# Altium project MiniPC MB GOST.PrjPcb (part 20 of 31)

## Sheet PCIE Connector.SchDoc
size 420 x 297 mm; Author: ALTIUM GOSTBOM2.0 KEV; SheetNumber: 16; SheetTotal: 48
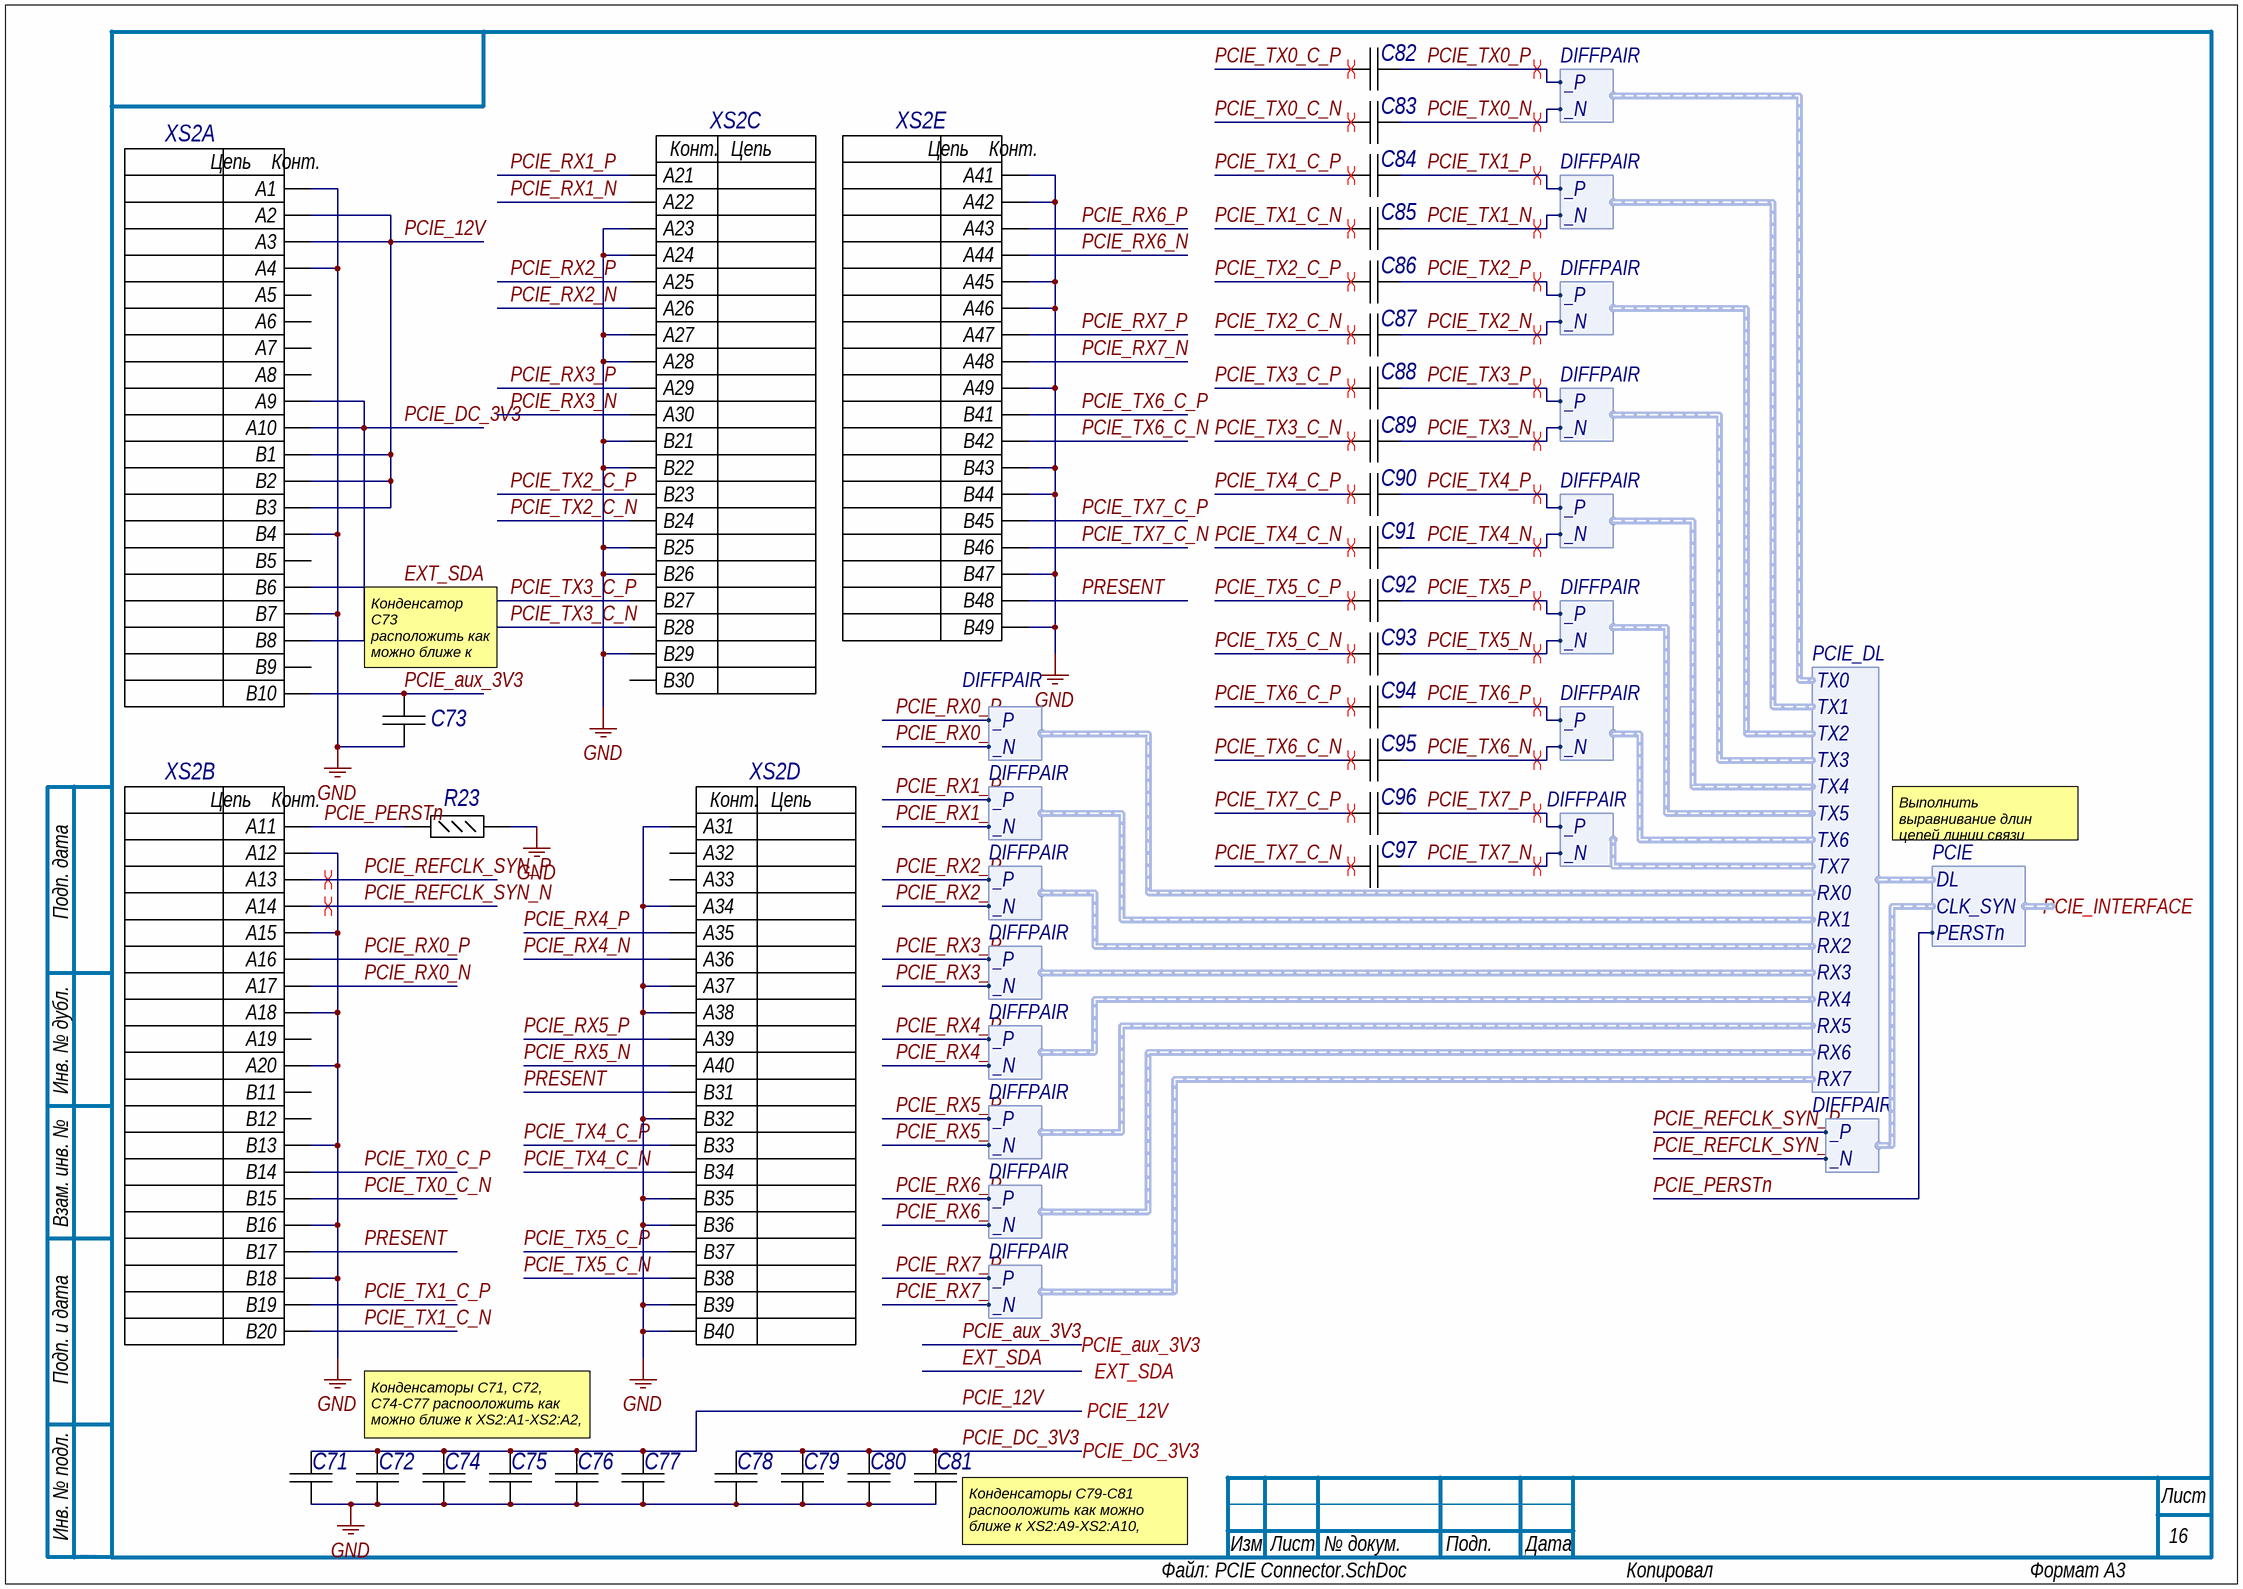
[diagram p27: PCIE Connector.SchDoc]

### Parts
C71  GRM31CR61E226KE15L  [CAPC3216X180X55ML20T25]  (value not drawn)
C72  C1005X7R1E104M  [CAPC1005X55X10LL05]  (value not drawn)
C73  C1005X7R1E104M  [CAPC1005X55X10LL05]  (value not drawn)
C74  C1005X7R1E104M  [CAPC1005X55X10LL05]  (value not drawn)
C75  C1005X7R1E104M  [CAPC1005X55X10LL05]  (value not drawn)
C76  C1005X7R1E104M  [CAPC1005X55X10LL05]  (value not drawn)
C77  C1005X7R1E104M  [CAPC1005X55X10LL05]  (value not drawn)
C78  C1005X7R1E104M  [CAPC1005X55X10LL05]  (value not drawn)
C79  C1005X7R1E104M  [CAPC1005X55X10LL05]  (value not drawn)
C80  C1005X7R1E104M  [CAPC1005X55X10LL05]  (value not drawn)
C81  GRM31CR60J107ME39L  [CAPC3216X190X55ML30T25]  (value not drawn)
C82  GRM155R61A224KE19D  [CAPC1005X55X25NL05T10]  (value not drawn)
C83  GRM155R61A224KE19D  [CAPC1005X55X25NL05T10]  (value not drawn)
C84  GRM155R61A224KE19D  [CAPC1005X55X25NL05T10]  (value not drawn)
C85  GRM155R61A224KE19D  [CAPC1005X55X25NL05T10]  (value not drawn)
C86  GRM155R61A224KE19D  [CAPC1005X55X25NL05T10]  (value not drawn)
C87  GRM155R61A224KE19D  [CAPC1005X55X25NL05T10]  (value not drawn)
C88  GRM155R61A224KE19D  [CAPC1005X55X25NL05T10]  (value not drawn)
C89  GRM155R61A224KE19D  [CAPC1005X55X25NL05T10]  (value not drawn)
C90  GRM155R61A224KE19D  [CAPC1005X55X25NL05T10]  (value not drawn)
C91  GRM155R61A224KE19D  [CAPC1005X55X25NL05T10]  (value not drawn)
C92  GRM155R61A224KE19D  [CAPC1005X55X25NL05T10]  (value not drawn)
C93  GRM155R61A224KE19D  [CAPC1005X55X25NL05T10]  (value not drawn)
C94  GRM155R61A224KE19D  [CAPC1005X55X25NL05T10]  (value not drawn)
C95  GRM155R61A224KE19D  [CAPC1005X55X25NL05T10]  (value not drawn)
C96  GRM155R61A224KE19D  [CAPC1005X55X25NL05T10]  (value not drawn)
C97  GRM155R61A224KE19D  [CAPC1005X55X25NL05T10]  (value not drawn)
R23  ERJ-2RKF4701X  [RESC1005X40X25LL05T05]  (value not drawn)
XS2  PCIE-098-02-F-D-TH  [SMTC-PCIE-098-02-F-D-TH_V]  (value not drawn)  (parts A,B,C,D,E of 5)

### Ports
EXT_SDA, PCIE_12V, PCIE_aux_3V3, PCIE_DC_3V3, PCIE_INTERFACE (harness PCIE)

### Harnesses
PCIE_DL: RX0, RX1, RX2, RX3, RX4, RX5, RX6, RX7, TX0, TX1, TX2, TX3, TX4, TX5, TX6, TX7
DIFFPAIR: _P, _N
PCIE: DL, CLK_SYN, PERSTn

### Nets
GND: C71.1 C72.1 C73.1 C74.1 C75.1 C76.1 C77.1 C78.1 C79.1 C80.1 C81.1 R23.2 XS2.A1 XS2.A4 XS2.A12 XS2.A15 XS2.A18 XS2.A20 XS2.A23 XS2.A24 XS2.A27 XS2.A28 XS2.A31 XS2.A34 XS2.A37 XS2.A38 XS2.A41 XS2.A42 XS2.A45 XS2.A46 XS2.A49 XS2.B4 XS2.B7 XS2.B13 XS2.B16 XS2.B18 XS2.B21 XS2.B22 XS2.B25 XS2.B26 XS2.B29 XS2.B32 XS2.B35 XS2.B36 XS2.B39 XS2.B40 XS2.B43 XS2.B44 XS2.B47 XS2.B49
EXT_SDA: XS2.B6 ; port EXT_SDA
PCIE_12V: C71.2 C72.2 C74.2 C75.2 C76.2 C77.2 XS2.A2 XS2.A3 XS2.B1 XS2.B2 XS2.B3 ; port PCIE_12V  [project net aux_12V]
PCIE_aux_3V3: C73.2 XS2.B10 ; port PCIE_aux_3V3  [project net PCIE_aux3V3]
PCIE_DC_3V3: C78.2 C79.2 C80.2 C81.2 XS2.A9 XS2.A10 XS2.B8 ; port PCIE_DC_3V3
PCIE_PERSTn: R23.1 XS2.A11 ; port PCIE_INTERFACE.PERSTn  [project net PCIE.PERSTn]
PCIE_REFCLK_SYN_N: XS2.A14 ; harness DIFFPAIR._N
PCIE_REFCLK_SYN_P: XS2.A13 ; harness DIFFPAIR._P
PCIE_RX0_N: XS2.A17 ; harness DIFFPAIR._N
PCIE_RX0_P: XS2.A16 ; harness DIFFPAIR._P
PCIE_RX1_N: XS2.A22 ; harness DIFFPAIR._N
PCIE_RX1_P: XS2.A21 ; harness DIFFPAIR._P
PCIE_RX2_N: XS2.A26 ; harness DIFFPAIR._N
PCIE_RX2_P: XS2.A25 ; harness DIFFPAIR._P
PCIE_RX3_N: XS2.A30 ; harness DIFFPAIR._N
PCIE_RX3_P: XS2.A29 ; harness DIFFPAIR._P
PCIE_RX4_N: XS2.A36 ; harness DIFFPAIR._N
PCIE_RX4_P: XS2.A35 ; harness DIFFPAIR._P
PCIE_RX5_N: XS2.A40 ; harness DIFFPAIR._N
PCIE_RX5_P: XS2.A39 ; harness DIFFPAIR._P
PCIE_RX6_N: XS2.A44 ; harness DIFFPAIR._N
PCIE_RX6_P: XS2.A43 ; harness DIFFPAIR._P
PCIE_RX7_N: XS2.A48 ; harness DIFFPAIR._N
PCIE_RX7_P: XS2.A47 ; harness DIFFPAIR._P
PCIE_TX0_C_N: C83.2 XS2.B15  [project net PCIE_TX0_C_N_16]
PCIE_TX0_C_P: C82.2 XS2.B14  [project net PCIE_TX0_C_P_16]
PCIE_TX0_N: C83.1 ; harness DIFFPAIR._N
PCIE_TX0_P: C82.1 ; harness DIFFPAIR._P
PCIE_TX1_C_N: C85.2 XS2.B20  [project net PCIE_TX1_C_N_16]
PCIE_TX1_C_P: C84.2 XS2.B19  [project net PCIE_TX1_C_P_16]
PCIE_TX1_N: C85.1 ; harness DIFFPAIR._N
PCIE_TX1_P: C84.1 ; harness DIFFPAIR._P
PCIE_TX2_C_N: C87.2 XS2.B24  [project net PCIE_TX2_C_N_16]
PCIE_TX2_C_P: C86.2 XS2.B23  [project net PCIE_TX2_C_P_16]
PCIE_TX2_N: C87.1 ; harness DIFFPAIR._N
PCIE_TX2_P: C86.1 ; harness DIFFPAIR._P
PCIE_TX3_C_N: C89.2 XS2.B28  [project net PCIE_TX3_C_N_16]
PCIE_TX3_C_P: C88.2 XS2.B27  [project net PCIE_TX3_C_P_16]
PCIE_TX3_N: C89.1 ; harness DIFFPAIR._N
PCIE_TX3_P: C88.1 ; harness DIFFPAIR._P
PCIE_TX4_C_N: C91.2 XS2.B34  [project net PCIE_TX4_C_N_16]
PCIE_TX4_C_P: C90.2 XS2.B33  [project net PCIE_TX4_C_P_16]
PCIE_TX4_N: C91.1 ; harness DIFFPAIR._N
PCIE_TX4_P: C90.1 ; harness DIFFPAIR._P
PCIE_TX5_C_N: C93.2 XS2.B38  [project net PCIE_TX5_C_N_16]
PCIE_TX5_C_P: C92.2 XS2.B37  [project net PCIE_TX5_C_P_16]
PCIE_TX5_N: C93.1 ; harness DIFFPAIR._N
PCIE_TX5_P: C92.1 ; harness DIFFPAIR._P
PCIE_TX6_C_N: C95.2 XS2.B42  [project net PCIE_TX6_C_N_16]
PCIE_TX6_C_P: C94.2 XS2.B41  [project net PCIE_TX6_C_P_16]
PCIE_TX6_N: C95.1 ; harness DIFFPAIR._N
PCIE_TX6_P: C94.1 ; harness DIFFPAIR._P
PCIE_TX7_C_N: C97.2 XS2.B46  [project net PCIE_TX7_C_N_16]
PCIE_TX7_C_P: C96.2 XS2.B45  [project net PCIE_TX7_C_P_16]
PCIE_TX7_N: C97.1 ; harness DIFFPAIR._N
PCIE_TX7_P: C96.1 ; harness DIFFPAIR._P
PRESENT: XS2.B17 XS2.B31 XS2.B48  [project net PRESENT_16]

Not connected (* = marked no-connect by the designer): XS2 A5 A6 A7 A8 A19 A32 A33 B5 B9 B11 B12 B30

### Layout directives
differential pair: PCIE_REFCLK_SYN_N, PCIE_REFCLK_SYN_P, PCIE_TX0_C_N_16, PCIE_TX0_C_P_16, PCIE_TX0_N, PCIE_TX0_P, PCIE_TX1_C_N_16, PCIE_TX1_C_P_16, PCIE_TX1_N, PCIE_TX1_P, PCIE_TX2_C_N_16, PCIE_TX2_C_P_16, PCIE_TX2_N, PCIE_TX2_P, PCIE_TX3_C_N_16, PCIE_TX3_C_P_16, PCIE_TX3_N, PCIE_TX3_P, PCIE_TX4_C_N_16, PCIE_TX4_C_P_16, PCIE_TX4_N, PCIE_TX4_P, PCIE_TX5_C_N_16, PCIE_TX5_C_P_16, PCIE_TX5_N, PCIE_TX5_P, PCIE_TX6_C_N_16, PCIE_TX6_C_P_16, PCIE_TX6_N, PCIE_TX6_P, PCIE_TX7_C_N_16, PCIE_TX7_C_P_16, PCIE_TX7_N, PCIE_TX7_P

### Notes on the sheet
- (near C73) Конденсатор C73 расположить как можно ближе к XS2:B10.
- Выполнить выравнивание длин цепей линии связи PCIE.DL.
- Конденсаторы C71, C72, C74-C77 распооложить как можно ближе к XS2:A1-XS2:A2, XS2:B1-XS2:B3.
- (near C81) Конденсаторы C79-C81 распооложить как можно ближе к XS2:A9-XS2:A10, XS2:B8.
- Подп. дата
- Инв. № дубл.
- Взам. инв. №
- Подп. и дата
- Инв. № подл.
- Изм.
- Лист
- № докум.
- Подп.
- Дата
- ALTIUM GOSTBOM2.0 KEV
- Файл:
- Копировал
- Формат А3
- (in symbol E41, part A) Цепь; Конт.
- (in symbol E41, part B) Цепь; Конт.
- (in symbol E41, part C) Конт.; Цепь
- (in symbol E41, part D) Конт.; Цепь
- (in symbol E41, part E) Цепь; Конт.

### Library data of the parts
C71 = E5: Chip Capacitor, 22 uF, +/- 10%, 25 V, -55 to 85 degC, 1206 (3216 Metric), RoHS, Tape and Reel; Тип элемента: Конденсатор; Capacitance: 22 uF; Case\/Package: 1206; Type (Capacitors): X5R; Voltage Rating: 25 V; Old_des: C500; New_des: C71; UID: E5; Component Kind: Standard; Case Code (Imperial): 1206; Case Code (Metric): 3216; ComponentLink1Description: Manufacturer URL; ComponentLink1URL: http://www.murata.com/; ComponentLink2Description: Datasheet; ComponentLink2URL: http://search.murata.co.jp/Ceramy/image/img/A01X/G101/ENG/GRM31CR61E226KE15-01.pdf; DatasheetVersion: 03/2016; Length: 3.2 mm; Max Operating Temperature: 85 degC; Min Operating Temperature: -55 degC; Mounting Technology: Surface Mount; Package Quantity: 2000; PackageDescription: 2-Pin Surface Mount Device, Body 3.2 x 1.6 mm; Packaging: Tape and Reel; PartNumber: GRM31CR61E226KE15L; RoHSCompliant: true; Tolerance: 10%; Width: 1.6 mm; Height: 1.6 mm; Mount: Surface Mount; PackageReference: 1206; Pins: 2; Radiation Hardening: No; REACH SVHC: No SVHC; Voltage Rating (DC): 25 V
C72 = E11: Chip Capacitor, 0.1 uF, +/- 20%, 25 V, -55 to 125 degC, 0402 (1005 Metric), RoHS, Tape and Reel; Тип элемента: Конденсатор; Capacitance: 100 nF; Case\/Package: 0402; Type (Capacitors): X7R; Voltage Rating: 25 V; Old_des: C501; New_des: C72; UID: E11; Component Kind: Standard; Case Code (Imperial): 0402; Case Code (Metric): 1005; ComponentLink1Description: Manufacturer URL; ComponentLink1URL: http://www.tdk.com/; ComponentLink2Description: Datasheet; ComponentLink2URL: http://www.farnell.com/datasheets/1571323.pdf; DatasheetVersion: 09/2011; Length: 1 mm; Max Operating Temperature: 125 degC; Min Operating Temperature: -55 degC; Mounting Technology: Surface Mount; Package Quantity: 10000; PackageDescription: 2-Pin Surface Mount Device, Body 1 x 0.5 mm; Packaging: Tape and Reel; PartNumber: C1005X7R1E104M; RoHSCompliant: true; Tolerance: 20%; Width: 0.5 mm; Height: 0.5 mm; Mount: Surface Mount; PackageReference: 0402; Pins: 2; Voltage Rating (DC): 25 V
C73 = E11: Chip Capacitor, 0.1 uF, +/- 20%, 25 V, -55 to 125 degC, 0402 (1005 Metric), RoHS, Tape and Reel; Тип элемента: Конденсатор; Capacitance: 100 nF; Case\/Package: 0402; Type (Capacitors): X7R; Voltage Rating: 25 V; Old_des: C483; New_des: C73; UID: E11; Component Kind: Standard; Case Code (Imperial): 0402; Case Code (Metric): 1005; ComponentLink1Description: Manufacturer URL; ComponentLink1URL: http://www.tdk.com/; ComponentLink2Description: Datasheet; ComponentLink2URL: http://www.farnell.com/datasheets/1571323.pdf; DatasheetVersion: 09/2011; Length: 1 mm; Max Operating Temperature: 125 degC; Min Operating Temperature: -55 degC; Mounting Technology: Surface Mount; Package Quantity: 10000; PackageDescription: 2-Pin Surface Mount Device, Body 1 x 0.5 mm; Packaging: Tape and Reel; PartNumber: C1005X7R1E104M; RoHSCompliant: true; Tolerance: 20%; Width: 0.5 mm; Height: 0.5 mm; Mount: Surface Mount; PackageReference: 0402; Pins: 2; Voltage Rating (DC): 25 V
C74 = E11: Chip Capacitor, 0.1 uF, +/- 20%, 25 V, -55 to 125 degC, 0402 (1005 Metric), RoHS, Tape and Reel; Тип элемента: Конденсатор; Capacitance: 100 nF; Case\/Package: 0402; Type (Capacitors): X7R; Voltage Rating: 25 V; Old_des: C502; New_des: C74; UID: E11; Component Kind: Standard; Case Code (Imperial): 0402; Case Code (Metric): 1005; ComponentLink1Description: Manufacturer URL; ComponentLink1URL: http://www.tdk.com/; ComponentLink2Description: Datasheet; ComponentLink2URL: http://www.farnell.com/datasheets/1571323.pdf; DatasheetVersion: 09/2011; Length: 1 mm; Max Operating Temperature: 125 degC; Min Operating Temperature: -55 degC; Mounting Technology: Surface Mount; Package Quantity: 10000; PackageDescription: 2-Pin Surface Mount Device, Body 1 x 0.5 mm; Packaging: Tape and Reel; PartNumber: C1005X7R1E104M; RoHSCompliant: true; Tolerance: 20%; Width: 0.5 mm; Height: 0.5 mm; Mount: Surface Mount; PackageReference: 0402; Pins: 2; Voltage Rating (DC): 25 V
C75 = E11: Chip Capacitor, 0.1 uF, +/- 20%, 25 V, -55 to 125 degC, 0402 (1005 Metric), RoHS, Tape and Reel; Тип элемента: Конденсатор; Capacitance: 100 nF; Case\/Package: 0402; Type (Capacitors): X7R; Voltage Rating: 25 V; Old_des: C503; New_des: C75; UID: E11; Component Kind: Standard; Case Code (Imperial): 0402; Case Code (Metric): 1005; ComponentLink1Description: Manufacturer URL; ComponentLink1URL: http://www.tdk.com/; ComponentLink2Description: Datasheet; ComponentLink2URL: http://www.farnell.com/datasheets/1571323.pdf; DatasheetVersion: 09/2011; Length: 1 mm; Max Operating Temperature: 125 degC; Min Operating Temperature: -55 degC; Mounting Technology: Surface Mount; Package Quantity: 10000; PackageDescription: 2-Pin Surface Mount Device, Body 1 x 0.5 mm; Packaging: Tape and Reel; PartNumber: C1005X7R1E104M; RoHSCompliant: true; Tolerance: 20%; Width: 0.5 mm; Height: 0.5 mm; Mount: Surface Mount; PackageReference: 0402; Pins: 2; Voltage Rating (DC): 25 V
C76 = E11: Chip Capacitor, 0.1 uF, +/- 20%, 25 V, -55 to 125 degC, 0402 (1005 Metric), RoHS, Tape and Reel; Тип элемента: Конденсатор; Capacitance: 100 nF; Case\/Package: 0402; Type (Capacitors): X7R; Voltage Rating: 25 V; Old_des: C504; New_des: C76; UID: E11; Component Kind: Standard; Case Code (Imperial): 0402; Case Code (Metric): 1005; ComponentLink1Description: Manufacturer URL; ComponentLink1URL: http://www.tdk.com/; ComponentLink2Description: Datasheet; ComponentLink2URL: http://www.farnell.com/datasheets/1571323.pdf; DatasheetVersion: 09/2011; Length: 1 mm; Max Operating Temperature: 125 degC; Min Operating Temperature: -55 degC; Mounting Technology: Surface Mount; Package Quantity: 10000; PackageDescription: 2-Pin Surface Mount Device, Body 1 x 0.5 mm; Packaging: Tape and Reel; PartNumber: C1005X7R1E104M; RoHSCompliant: true; Tolerance: 20%; Width: 0.5 mm; Height: 0.5 mm; Mount: Surface Mount; PackageReference: 0402; Pins: 2; Voltage Rating (DC): 25 V
C77 = E11: Chip Capacitor, 0.1 uF, +/- 20%, 25 V, -55 to 125 degC, 0402 (1005 Metric), RoHS, Tape and Reel; Тип элемента: Конденсатор; Capacitance: 100 nF; Case\/Package: 0402; Type (Capacitors): X7R; Voltage Rating: 25 V; Old_des: C505; New_des: C77; UID: E11; Component Kind: Standard; Case Code (Imperial): 0402; Case Code (Metric): 1005; ComponentLink1Description: Manufacturer URL; ComponentLink1URL: http://www.tdk.com/; ComponentLink2Description: Datasheet; ComponentLink2URL: http://www.farnell.com/datasheets/1571323.pdf; DatasheetVersion: 09/2011; Length: 1 mm; Max Operating Temperature: 125 degC; Min Operating Temperature: -55 degC; Mounting Technology: Surface Mount; Package Quantity: 10000; PackageDescription: 2-Pin Surface Mount Device, Body 1 x 0.5 mm; Packaging: Tape and Reel; PartNumber: C1005X7R1E104M; RoHSCompliant: true; Tolerance: 20%; Width: 0.5 mm; Height: 0.5 mm; Mount: Surface Mount; PackageReference: 0402; Pins: 2; Voltage Rating (DC): 25 V
C78 = E11: Chip Capacitor, 0.1 uF, +/- 20%, 25 V, -55 to 125 degC, 0402 (1005 Metric), RoHS, Tape and Reel; Тип элемента: Конденсатор; Capacitance: 100 nF; Case\/Package: 0402; Type (Capacitors): X7R; Voltage Rating: 25 V; Old_des: C506; New_des: C78; UID: E11; Component Kind: Standard; Case Code (Imperial): 0402; Case Code (Metric): 1005; ComponentLink1Description: Manufacturer URL; ComponentLink1URL: http://www.tdk.com/; ComponentLink2Description: Datasheet; ComponentLink2URL: http://www.farnell.com/datasheets/1571323.pdf; DatasheetVersion: 09/2011; Length: 1 mm; Max Operating Temperature: 125 degC; Min Operating Temperature: -55 degC; Mounting Technology: Surface Mount; Package Quantity: 10000; PackageDescription: 2-Pin Surface Mount Device, Body 1 x 0.5 mm; Packaging: Tape and Reel; PartNumber: C1005X7R1E104M; RoHSCompliant: true; Tolerance: 20%; Width: 0.5 mm; Height: 0.5 mm; Mount: Surface Mount; PackageReference: 0402; Pins: 2; Voltage Rating (DC): 25 V
C79 = E11: Chip Capacitor, 0.1 uF, +/- 20%, 25 V, -55 to 125 degC, 0402 (1005 Metric), RoHS, Tape and Reel; Тип элемента: Конденсатор; Capacitance: 100 nF; Case\/Package: 0402; Type (Capacitors): X7R; Voltage Rating: 25 V; Old_des: C507; New_des: C79; UID: E11; Component Kind: Standard; Case Code (Imperial): 0402; Case Code (Metric): 1005; ComponentLink1Description: Manufacturer URL; ComponentLink1URL: http://www.tdk.com/; ComponentLink2Description: Datasheet; ComponentLink2URL: http://www.farnell.com/datasheets/1571323.pdf; DatasheetVersion: 09/2011; Length: 1 mm; Max Operating Temperature: 125 degC; Min Operating Temperature: -55 degC; Mounting Technology: Surface Mount; Package Quantity: 10000; PackageDescription: 2-Pin Surface Mount Device, Body 1 x 0.5 mm; Packaging: Tape and Reel; PartNumber: C1005X7R1E104M; RoHSCompliant: true; Tolerance: 20%; Width: 0.5 mm; Height: 0.5 mm; Mount: Surface Mount; PackageReference: 0402; Pins: 2; Voltage Rating (DC): 25 V
C80 = E11: Chip Capacitor, 0.1 uF, +/- 20%, 25 V, -55 to 125 degC, 0402 (1005 Metric), RoHS, Tape and Reel; Тип элемента: Конденсатор; Capacitance: 100 nF; Case\/Package: 0402; Type (Capacitors): X7R; Voltage Rating: 25 V; Old_des: C508; New_des: C80; UID: E11; Component Kind: Standard; Case Code (Imperial): 0402; Case Code (Metric): 1005; ComponentLink1Description: Manufacturer URL; ComponentLink1URL: http://www.tdk.com/; ComponentLink2Description: Datasheet; ComponentLink2URL: http://www.farnell.com/datasheets/1571323.pdf; DatasheetVersion: 09/2011; Length: 1 mm; Max Operating Temperature: 125 degC; Min Operating Temperature: -55 degC; Mounting Technology: Surface Mount; Package Quantity: 10000; PackageDescription: 2-Pin Surface Mount Device, Body 1 x 0.5 mm; Packaging: Tape and Reel; PartNumber: C1005X7R1E104M; RoHSCompliant: true; Tolerance: 20%; Width: 0.5 mm; Height: 0.5 mm; Mount: Surface Mount; PackageReference: 0402; Pins: 2; Voltage Rating (DC): 25 V
C81 = E14: Chip Capacitor, 100 uF, +/- 20%, 6.3 V, -55 to 85 degC, 1206 (3216 Metric), RoHS, Tape and Reel; Тип элемента: Конденсатор; Capacitance: 100 uF; Case\/Package: 1206; Type (Capacitors): X5R; Voltage Rating: 6.3 V; Old_des: C509; New_des: C81; UID: E14; Component Kind: Standard; Case Code (Imperial): 1206; Case Code (Metric): 3216; ComponentLink1Description: Manufacturer URL; ComponentLink1URL: http://www.murata.com/; ComponentLink2Description: Datasheet; ComponentLink2URL: http://psearch.en.murata.com/capacitor/product/GRM31CR60J107ME39%23.pdf; DatasheetVersion: 09/2016; Length: 3.2 mm; Max Operating Temperature: 85 degC; Min Operating Temperature: -55 degC; Mounting Technology: Surface Mount; Package Quantity: 2000; PackageDescription: 2-Pin Surface Mount Device, Body 3.2 x 1.6 mm; Packaging: Tape and Reel; PartNumber: GRM31CR60J107ME39L; RoHSCompliant: true; Tolerance: 20%; Width: 1.6 mm; Height: 1.6 mm; Mount: Surface Mount; PackageReference: 1206; Pins: 2; Radiation Hardening: No; REACH SVHC: No SVHC; Voltage Rating (DC): 6.3 V
C82 = E7: Chip Capacitor, 220 nF, +/- 10%, 10 V, -55 to 85 degC, 0402 (1005 Metric), RoHS, Tape and Reel; Manufacturer: Basic Passives; Тип элемента: Конденсатор; Capacitance: 220 nF; Case\/Package: 0402; Type (Capacitors): X5R; Voltage Rating: 10 V; Old_des: C484; New_des: C82; UID: E7; Component Kind: Standard; Case Code (Imperial): 0402; Case Code (Metric): 1005; ComponentLink1Description: Manufacturer URL; ComponentLink1URL: http://www.murata.com/; ComponentLink2Description: Datasheet; ComponentLink2URL: http://search.murata.co.jp/Ceramy/image/img/A01X/G101/ENG/GRM155R61A224KE19-01.pdf; DatasheetVersion: 03/2016; Length: 1 mm; Max Operating Temperature: 85 degC; Min Operating Temperature: -55 degC; Mounting Technology: Surface Mount; Package Quantity: 1; PackageDescription: 2-Pin Surface Mount Device, Body 1 x 0.5 mm; Packaging: Tape and Reel; PartNumber: GRM155R61A224KE19D; RoHSCompliant: true; Tolerance: 10%; Width: 0.5 mm; Height: 0.5 mm; Mount: Surface Mount; PackageReference: 0402; Pins: 2; Radiation Hardening: No; REACH SVHC: No SVHC; Voltage Rating (DC): 10 V
C83 = E7: Chip Capacitor, 220 nF, +/- 10%, 10 V, -55 to 85 degC, 0402 (1005 Metric), RoHS, Tape and Reel; Manufacturer: Basic Passives; Тип элемента: Конденсатор; Capacitance: 220 nF; Case\/Package: 0402; Type (Capacitors): X5R; Voltage Rating: 10 V; Old_des: C485; New_des: C83; UID: E7; Component Kind: Standard; Case Code (Imperial): 0402; Case Code (Metric): 1005; ComponentLink1Description: Manufacturer URL; ComponentLink1URL: http://www.murata.com/; ComponentLink2Description: Datasheet; ComponentLink2URL: http://search.murata.co.jp/Ceramy/image/img/A01X/G101/ENG/GRM155R61A224KE19-01.pdf; DatasheetVersion: 03/2016; Length: 1 mm; Max Operating Temperature: 85 degC; Min Operating Temperature: -55 degC; Mounting Technology: Surface Mount; Package Quantity: 1; PackageDescription: 2-Pin Surface Mount Device, Body 1 x 0.5 mm; Packaging: Tape and Reel; PartNumber: GRM155R61A224KE19D; RoHSCompliant: true; Tolerance: 10%; Width: 0.5 mm; Height: 0.5 mm; Mount: Surface Mount; PackageReference: 0402; Pins: 2; Radiation Hardening: No; REACH SVHC: No SVHC; Voltage Rating (DC): 10 V
C84 = E7: Chip Capacitor, 220 nF, +/- 10%, 10 V, -55 to 85 degC, 0402 (1005 Metric), RoHS, Tape and Reel; Manufacturer: Basic Passives; Тип элемента: Конденсатор; Capacitance: 220 nF; Case\/Package: 0402; Type (Capacitors): X5R; Voltage Rating: 10 V; Old_des: C486; New_des: C84; UID: E7; Component Kind: Standard; Case Code (Imperial): 0402; Case Code (Metric): 1005; ComponentLink1Description: Manufacturer URL; ComponentLink1URL: http://www.murata.com/; ComponentLink2Description: Datasheet; ComponentLink2URL: http://search.murata.co.jp/Ceramy/image/img/A01X/G101/ENG/GRM155R61A224KE19-01.pdf; DatasheetVersion: 03/2016; Length: 1 mm; Max Operating Temperature: 85 degC; Min Operating Temperature: -55 degC; Mounting Technology: Surface Mount; Package Quantity: 1; PackageDescription: 2-Pin Surface Mount Device, Body 1 x 0.5 mm; Packaging: Tape and Reel; PartNumber: GRM155R61A224KE19D; RoHSCompliant: true; Tolerance: 10%; Width: 0.5 mm; Height: 0.5 mm; Mount: Surface Mount; PackageReference: 0402; Pins: 2; Radiation Hardening: No; REACH SVHC: No SVHC; Voltage Rating (DC): 10 V
C85 = E7: Chip Capacitor, 220 nF, +/- 10%, 10 V, -55 to 85 degC, 0402 (1005 Metric), RoHS, Tape and Reel; Manufacturer: Basic Passives; Тип элемента: Конденсатор; Capacitance: 220 nF; Case\/Package: 0402; Type (Capacitors): X5R; Voltage Rating: 10 V; Old_des: C487; New_des: C85; UID: E7; Component Kind: Standard; Case Code (Imperial): 0402; Case Code (Metric): 1005; ComponentLink1Description: Manufacturer URL; ComponentLink1URL: http://www.murata.com/; ComponentLink2Description: Datasheet; ComponentLink2URL: http://search.murata.co.jp/Ceramy/image/img/A01X/G101/ENG/GRM155R61A224KE19-01.pdf; DatasheetVersion: 03/2016; Length: 1 mm; Max Operating Temperature: 85 degC; Min Operating Temperature: -55 degC; Mounting Technology: Surface Mount; Package Quantity: 1; PackageDescription: 2-Pin Surface Mount Device, Body 1 x 0.5 mm; Packaging: Tape and Reel; PartNumber: GRM155R61A224KE19D; RoHSCompliant: true; Tolerance: 10%; Width: 0.5 mm; Height: 0.5 mm; Mount: Surface Mount; PackageReference: 0402; Pins: 2; Radiation Hardening: No; REACH SVHC: No SVHC; Voltage Rating (DC): 10 V
C86 = E7: Chip Capacitor, 220 nF, +/- 10%, 10 V, -55 to 85 degC, 0402 (1005 Metric), RoHS, Tape and Reel; Manufacturer: Basic Passives; Тип элемента: Конденсатор; Capacitance: 220 nF; Case\/Package: 0402; Type (Capacitors): X5R; Voltage Rating: 10 V; Old_des: C488; New_des: C86; UID: E7; Component Kind: Standard; Case Code (Imperial): 0402; Case Code (Metric): 1005; ComponentLink1Description: Manufacturer URL; ComponentLink1URL: http://www.murata.com/; ComponentLink2Description: Datasheet; ComponentLink2URL: http://search.murata.co.jp/Ceramy/image/img/A01X/G101/ENG/GRM155R61A224KE19-01.pdf; DatasheetVersion: 03/2016; Length: 1 mm; Max Operating Temperature: 85 degC; Min Operating Temperature: -55 degC; Mounting Technology: Surface Mount; Package Quantity: 1; PackageDescription: 2-Pin Surface Mount Device, Body 1 x 0.5 mm; Packaging: Tape and Reel; PartNumber: GRM155R61A224KE19D; RoHSCompliant: true; Tolerance: 10%; Width: 0.5 mm; Height: 0.5 mm; Mount: Surface Mount; PackageReference: 0402; Pins: 2; Radiation Hardening: No; REACH SVHC: No SVHC; Voltage Rating (DC): 10 V
C87 = E7: Chip Capacitor, 220 nF, +/- 10%, 10 V, -55 to 85 degC, 0402 (1005 Metric), RoHS, Tape and Reel; Manufacturer: Basic Passives; Тип элемента: Конденсатор; Capacitance: 220 nF; Case\/Package: 0402; Type (Capacitors): X5R; Voltage Rating: 10 V; Old_des: C489; New_des: C87; UID: E7; Component Kind: Standard; Case Code (Imperial): 0402; Case Code (Metric): 1005; ComponentLink1Description: Manufacturer URL; ComponentLink1URL: http://www.murata.com/; ComponentLink2Description: Datasheet; ComponentLink2URL: http://search.murata.co.jp/Ceramy/image/img/A01X/G101/ENG/GRM155R61A224KE19-01.pdf; DatasheetVersion: 03/2016; Length: 1 mm; Max Operating Temperature: 85 degC; Min Operating Temperature: -55 degC; Mounting Technology: Surface Mount; Package Quantity: 1; PackageDescription: 2-Pin Surface Mount Device, Body 1 x 0.5 mm; Packaging: Tape and Reel; PartNumber: GRM155R61A224KE19D; RoHSCompliant: true; Tolerance: 10%; Width: 0.5 mm; Height: 0.5 mm; Mount: Surface Mount; PackageReference: 0402; Pins: 2; Radiation Hardening: No; REACH SVHC: No SVHC; Voltage Rating (DC): 10 V
C88 = E7: Chip Capacitor, 220 nF, +/- 10%, 10 V, -55 to 85 degC, 0402 (1005 Metric), RoHS, Tape and Reel; Manufacturer: Basic Passives; Тип элемента: Конденсатор; Capacitance: 220 nF; Case\/Package: 0402; Type (Capacitors): X5R; Voltage Rating: 10 V; Old_des: C490; New_des: C88; UID: E7; Component Kind: Standard; Case Code (Imperial): 0402; Case Code (Metric): 1005; ComponentLink1Description: Manufacturer URL; ComponentLink1URL: http://www.murata.com/; ComponentLink2Description: Datasheet; ComponentLink2URL: http://search.murata.co.jp/Ceramy/image/img/A01X/G101/ENG/GRM155R61A224KE19-01.pdf; DatasheetVersion: 03/2016; Length: 1 mm; Max Operating Temperature: 85 degC; Min Operating Temperature: -55 degC; Mounting Technology: Surface Mount; Package Quantity: 1; PackageDescription: 2-Pin Surface Mount Device, Body 1 x 0.5 mm; Packaging: Tape and Reel; PartNumber: GRM155R61A224KE19D; RoHSCompliant: true; Tolerance: 10%; Width: 0.5 mm; Height: 0.5 mm; Mount: Surface Mount; PackageReference: 0402; Pins: 2; Radiation Hardening: No; REACH SVHC: No SVHC; Voltage Rating (DC): 10 V
C89 = E7: Chip Capacitor, 220 nF, +/- 10%, 10 V, -55 to 85 degC, 0402 (1005 Metric), RoHS, Tape and Reel; Manufacturer: Basic Passives; Тип элемента: Конденсатор; Capacitance: 220 nF; Case\/Package: 0402; Type (Capacitors): X5R; Voltage Rating: 10 V; Old_des: C491; New_des: C89; UID: E7; Component Kind: Standard; Case Code (Imperial): 0402; Case Code (Metric): 1005; ComponentLink1Description: Manufacturer URL; ComponentLink1URL: http://www.murata.com/; ComponentLink2Description: Datasheet; ComponentLink2URL: http://search.murata.co.jp/Ceramy/image/img/A01X/G101/ENG/GRM155R61A224KE19-01.pdf; DatasheetVersion: 03/2016; Length: 1 mm; Max Operating Temperature: 85 degC; Min Operating Temperature: -55 degC; Mounting Technology: Surface Mount; Package Quantity: 1; PackageDescription: 2-Pin Surface Mount Device, Body 1 x 0.5 mm; Packaging: Tape and Reel; PartNumber: GRM155R61A224KE19D; RoHSCompliant: true; Tolerance: 10%; Width: 0.5 mm; Height: 0.5 mm; Mount: Surface Mount; PackageReference: 0402; Pins: 2; Radiation Hardening: No; REACH SVHC: No SVHC; Voltage Rating (DC): 10 V
C90 = E7: Chip Capacitor, 220 nF, +/- 10%, 10 V, -55 to 85 degC, 0402 (1005 Metric), RoHS, Tape and Reel; Manufacturer: Basic Passives; Тип элемента: Конденсатор; Capacitance: 220 nF; Case\/Package: 0402; Type (Capacitors): X5R; Voltage Rating: 10 V; Old_des: C492; New_des: C90; UID: E7; Component Kind: Standard; Case Code (Imperial): 0402; Case Code (Metric): 1005; ComponentLink1Description: Manufacturer URL; ComponentLink1URL: http://www.murata.com/; ComponentLink2Description: Datasheet; ComponentLink2URL: http://search.murata.co.jp/Ceramy/image/img/A01X/G101/ENG/GRM155R61A224KE19-01.pdf; DatasheetVersion: 03/2016; Length: 1 mm; Max Operating Temperature: 85 degC; Min Operating Temperature: -55 degC; Mounting Technology: Surface Mount; Package Quantity: 1; PackageDescription: 2-Pin Surface Mount Device, Body 1 x 0.5 mm; Packaging: Tape and Reel; PartNumber: GRM155R61A224KE19D; RoHSCompliant: true; Tolerance: 10%; Width: 0.5 mm; Height: 0.5 mm; Mount: Surface Mount; PackageReference: 0402; Pins: 2; Radiation Hardening: No; REACH SVHC: No SVHC; Voltage Rating (DC): 10 V
C91 = E7: Chip Capacitor, 220 nF, +/- 10%, 10 V, -55 to 85 degC, 0402 (1005 Metric), RoHS, Tape and Reel; Manufacturer: Basic Passives; Тип элемента: Конденсатор; Capacitance: 220 nF; Case\/Package: 0402; Type (Capacitors): X5R; Voltage Rating: 10 V; Old_des: C493; New_des: C91; UID: E7; Component Kind: Standard; Case Code (Imperial): 0402; Case Code (Metric): 1005; ComponentLink1Description: Manufacturer URL; ComponentLink1URL: http://www.murata.com/; ComponentLink2Description: Datasheet; ComponentLink2URL: http://search.murata.co.jp/Ceramy/image/img/A01X/G101/ENG/GRM155R61A224KE19-01.pdf; DatasheetVersion: 03/2016; Length: 1 mm; Max Operating Temperature: 85 degC; Min Operating Temperature: -55 degC; Mounting Technology: Surface Mount; Package Quantity: 1; PackageDescription: 2-Pin Surface Mount Device, Body 1 x 0.5 mm; Packaging: Tape and Reel; PartNumber: GRM155R61A224KE19D; RoHSCompliant: true; Tolerance: 10%; Width: 0.5 mm; Height: 0.5 mm; Mount: Surface Mount; PackageReference: 0402; Pins: 2; Radiation Hardening: No; REACH SVHC: No SVHC; Voltage Rating (DC): 10 V
C92 = E7: Chip Capacitor, 220 nF, +/- 10%, 10 V, -55 to 85 degC, 0402 (1005 Metric), RoHS, Tape and Reel; Manufacturer: Basic Passives; Тип элемента: Конденсатор; Capacitance: 220 nF; Case\/Package: 0402; Type (Capacitors): X5R; Voltage Rating: 10 V; Old_des: C494; New_des: C92; UID: E7; Component Kind: Standard; Case Code (Imperial): 0402; Case Code (Metric): 1005; ComponentLink1Description: Manufacturer URL; ComponentLink1URL: http://www.murata.com/; ComponentLink2Description: Datasheet; ComponentLink2URL: http://search.murata.co.jp/Ceramy/image/img/A01X/G101/ENG/GRM155R61A224KE19-01.pdf; DatasheetVersion: 03/2016; Length: 1 mm; Max Operating Temperature: 85 degC; Min Operating Temperature: -55 degC; Mounting Technology: Surface Mount; Package Quantity: 1; PackageDescription: 2-Pin Surface Mount Device, Body 1 x 0.5 mm; Packaging: Tape and Reel; PartNumber: GRM155R61A224KE19D; RoHSCompliant: true; Tolerance: 10%; Width: 0.5 mm; Height: 0.5 mm; Mount: Surface Mount; PackageReference: 0402; Pins: 2; Radiation Hardening: No; REACH SVHC: No SVHC; Voltage Rating (DC): 10 V
C93 = E7: Chip Capacitor, 220 nF, +/- 10%, 10 V, -55 to 85 degC, 0402 (1005 Metric), RoHS, Tape and Reel; Manufacturer: Basic Passives; Тип элемента: Конденсатор; Capacitance: 220 nF; Case\/Package: 0402; Type (Capacitors): X5R; Voltage Rating: 10 V; Old_des: C495; New_des: C93; UID: E7; Component Kind: Standard; Case Code (Imperial): 0402; Case Code (Metric): 1005; ComponentLink1Description: Manufacturer URL; ComponentLink1URL: http://www.murata.com/; ComponentLink2Description: Datasheet; ComponentLink2URL: http://search.murata.co.jp/Ceramy/image/img/A01X/G101/ENG/GRM155R61A224KE19-01.pdf; DatasheetVersion: 03/2016; Length: 1 mm; Max Operating Temperature: 85 degC; Min Operating Temperature: -55 degC; Mounting Technology: Surface Mount; Package Quantity: 1; PackageDescription: 2-Pin Surface Mount Device, Body 1 x 0.5 mm; Packaging: Tape and Reel; PartNumber: GRM155R61A224KE19D; RoHSCompliant: true; Tolerance: 10%; Width: 0.5 mm; Height: 0.5 mm; Mount: Surface Mount; PackageReference: 0402; Pins: 2; Radiation Hardening: No; REACH SVHC: No SVHC; Voltage Rating (DC): 10 V
C94 = E7: Chip Capacitor, 220 nF, +/- 10%, 10 V, -55 to 85 degC, 0402 (1005 Metric), RoHS, Tape and Reel; Manufacturer: Basic Passives; Тип элемента: Конденсатор; Capacitance: 220 nF; Case\/Package: 0402; Type (Capacitors): X5R; Voltage Rating: 10 V; Old_des: C496; New_des: C94; UID: E7; Component Kind: Standard; Case Code (Imperial): 0402; Case Code (Metric): 1005; ComponentLink1Description: Manufacturer URL; ComponentLink1URL: http://www.murata.com/; ComponentLink2Description: Datasheet; ComponentLink2URL: http://search.murata.co.jp/Ceramy/image/img/A01X/G101/ENG/GRM155R61A224KE19-01.pdf; DatasheetVersion: 03/2016; Length: 1 mm; Max Operating Temperature: 85 degC; Min Operating Temperature: -55 degC; Mounting Technology: Surface Mount; Package Quantity: 1; PackageDescription: 2-Pin Surface Mount Device, Body 1 x 0.5 mm; Packaging: Tape and Reel; PartNumber: GRM155R61A224KE19D; RoHSCompliant: true; Tolerance: 10%; Width: 0.5 mm; Height: 0.5 mm; Mount: Surface Mount; PackageReference: 0402; Pins: 2; Radiation Hardening: No; REACH SVHC: No SVHC; Voltage Rating (DC): 10 V
C95 = E7: Chip Capacitor, 220 nF, +/- 10%, 10 V, -55 to 85 degC, 0402 (1005 Metric), RoHS, Tape and Reel; Manufacturer: Basic Passives; Тип элемента: Конденсатор; Capacitance: 220 nF; Case\/Package: 0402; Type (Capacitors): X5R; Voltage Rating: 10 V; Old_des: C497; New_des: C95; UID: E7; Component Kind: Standard; Case Code (Imperial): 0402; Case Code (Metric): 1005; ComponentLink1Description: Manufacturer URL; ComponentLink1URL: http://www.murata.com/; ComponentLink2Description: Datasheet; ComponentLink2URL: http://search.murata.co.jp/Ceramy/image/img/A01X/G101/ENG/GRM155R61A224KE19-01.pdf; DatasheetVersion: 03/2016; Length: 1 mm; Max Operating Temperature: 85 degC; Min Operating Temperature: -55 degC; Mounting Technology: Surface Mount; Package Quantity: 1; PackageDescription: 2-Pin Surface Mount Device, Body 1 x 0.5 mm; Packaging: Tape and Reel; PartNumber: GRM155R61A224KE19D; RoHSCompliant: true; Tolerance: 10%; Width: 0.5 mm; Height: 0.5 mm; Mount: Surface Mount; PackageReference: 0402; Pins: 2; Radiation Hardening: No; REACH SVHC: No SVHC; Voltage Rating (DC): 10 V
C96 = E7: Chip Capacitor, 220 nF, +/- 10%, 10 V, -55 to 85 degC, 0402 (1005 Metric), RoHS, Tape and Reel; Manufacturer: Basic Passives; Тип элемента: Конденсатор; Capacitance: 220 nF; Case\/Package: 0402; Type (Capacitors): X5R; Voltage Rating: 10 V; Old_des: C498; New_des: C96; UID: E7; Component Kind: Standard; Case Code (Imperial): 0402; Case Code (Metric): 1005; ComponentLink1Description: Manufacturer URL; ComponentLink1URL: http://www.murata.com/; ComponentLink2Description: Datasheet; ComponentLink2URL: http://search.murata.co.jp/Ceramy/image/img/A01X/G101/ENG/GRM155R61A224KE19-01.pdf; DatasheetVersion: 03/2016; Length: 1 mm; Max Operating Temperature: 85 degC; Min Operating Temperature: -55 degC; Mounting Technology: Surface Mount; Package Quantity: 1; PackageDescription: 2-Pin Surface Mount Device, Body 1 x 0.5 mm; Packaging: Tape and Reel; PartNumber: GRM155R61A224KE19D; RoHSCompliant: true; Tolerance: 10%; Width: 0.5 mm; Height: 0.5 mm; Mount: Surface Mount; PackageReference: 0402; Pins: 2; Radiation Hardening: No; REACH SVHC: No SVHC; Voltage Rating (DC): 10 V
C97 = E7: Chip Capacitor, 220 nF, +/- 10%, 10 V, -55 to 85 degC, 0402 (1005 Metric), RoHS, Tape and Reel; Manufacturer: Basic Passives; Тип элемента: Конденсатор; Capacitance: 220 nF; Case\/Package: 0402; Type (Capacitors): X5R; Voltage Rating: 10 V; Old_des: C499; New_des: C97; UID: E7; Component Kind: Standard; Case Code (Imperial): 0402; Case Code (Metric): 1005; ComponentLink1Description: Manufacturer URL; ComponentLink1URL: http://www.murata.com/; ComponentLink2Description: Datasheet; ComponentLink2URL: http://search.murata.co.jp/Ceramy/image/img/A01X/G101/ENG/GRM155R61A224KE19-01.pdf; DatasheetVersion: 03/2016; Length: 1 mm; Max Operating Temperature: 85 degC; Min Operating Temperature: -55 degC; Mounting Technology: Surface Mount; Package Quantity: 1; PackageDescription: 2-Pin Surface Mount Device, Body 1 x 0.5 mm; Packaging: Tape and Reel; PartNumber: GRM155R61A224KE19D; RoHSCompliant: true; Tolerance: 10%; Width: 0.5 mm; Height: 0.5 mm; Mount: Surface Mount; PackageReference: 0402; Pins: 2; Radiation Hardening: No; REACH SVHC: No SVHC; Voltage Rating (DC): 10 V
R23 = E99: Chip Resistor, 4.7 KOhm, +/- 1%, 0.1 W, -55 to 155 degC, 0402 (1005 Metric), RoHS, Tape and Reel; Тип элемента: Резистор; Case\/Package: 0402; Voltage Rating: 50 V; Power Rating: 100 mW; Old_des: R332; New_des: R23; UID: E99; Component Kind: Standard; Case Code (Imperial): 0402; Case Code (Metric): 1005; ComponentLink1Description: Manufacturer URL; ComponentLink1URL: http://www.panasonic.com/; ComponentLink2Description: Datasheet; ComponentLink2URL: http://industrial.panasonic.com/cdbs/www-data/pdf/RDA0000/AOA0000C86.pdf; DatasheetVersion: 04/2015; Length: 1 mm; Max Operating Temperature: 155 degC; Min Operating Temperature: -55 degC; Mounting Technology: Surface Mount; Package Quantity: 1; PackageDescription: 2-Pin Surface Mount Device, Body 1 x 0.5 mm; Packaging: Cut Tape; PartNumber: ERJ-2RKF4701X; RoHSCompliant: true; Tolerance: 1%; Width: 0.5 mm; Height: 0.35 mm; Mount: Surface Mount; PackageReference: 0402; Pins: 2; Radiation Hardening: No; REACH SVHC: Yes; Resistance: 4.7 KOhm
XS2 = E41: Female Header, Pitch 1 mm, 98 Positions, 4 Rows, Height 11 mm, Tail Length 2.31 mm, -55 to 125 degC, RoHS; Manufacturer: Samtec; Тип элемента: Соединитель; Old_des: J14; New_des: XS2; UID: E41; Component Kind: Standard; ComponentLink1Description: Manufacturer URL; ComponentLink1URL: http://www.samtec.com/; ComponentLink2Description: Datasheet; ComponentLink2URL: http://suddendocs.samtec.com/catalog_english/pcie.pdf; DatasheetVersion: Rev. 21JAN16; Mounting Technology: Through Hole; PackageDescription: Female Header, Pitch 1 mm, 98 Positions, 4 Rows, Height 11 mm, Tail Length 2.31 mm; PartNumber: PCIE-098-02-F-D-TH; PackageReference: PCIE-098-02-F-D-TH; ComponentLink3Description: Package Specification; ComponentLink3URL: http://suddendocs.samtec.com/prints/pcie-xxx-02-x-d-th-footprint.pdf

## Sheet Clock group.SchDoc
size 594 x 420 mm; Author: ALTIUM GOSTBOM2.0 KEV; SheetNumber: 2; SheetTotal: 48
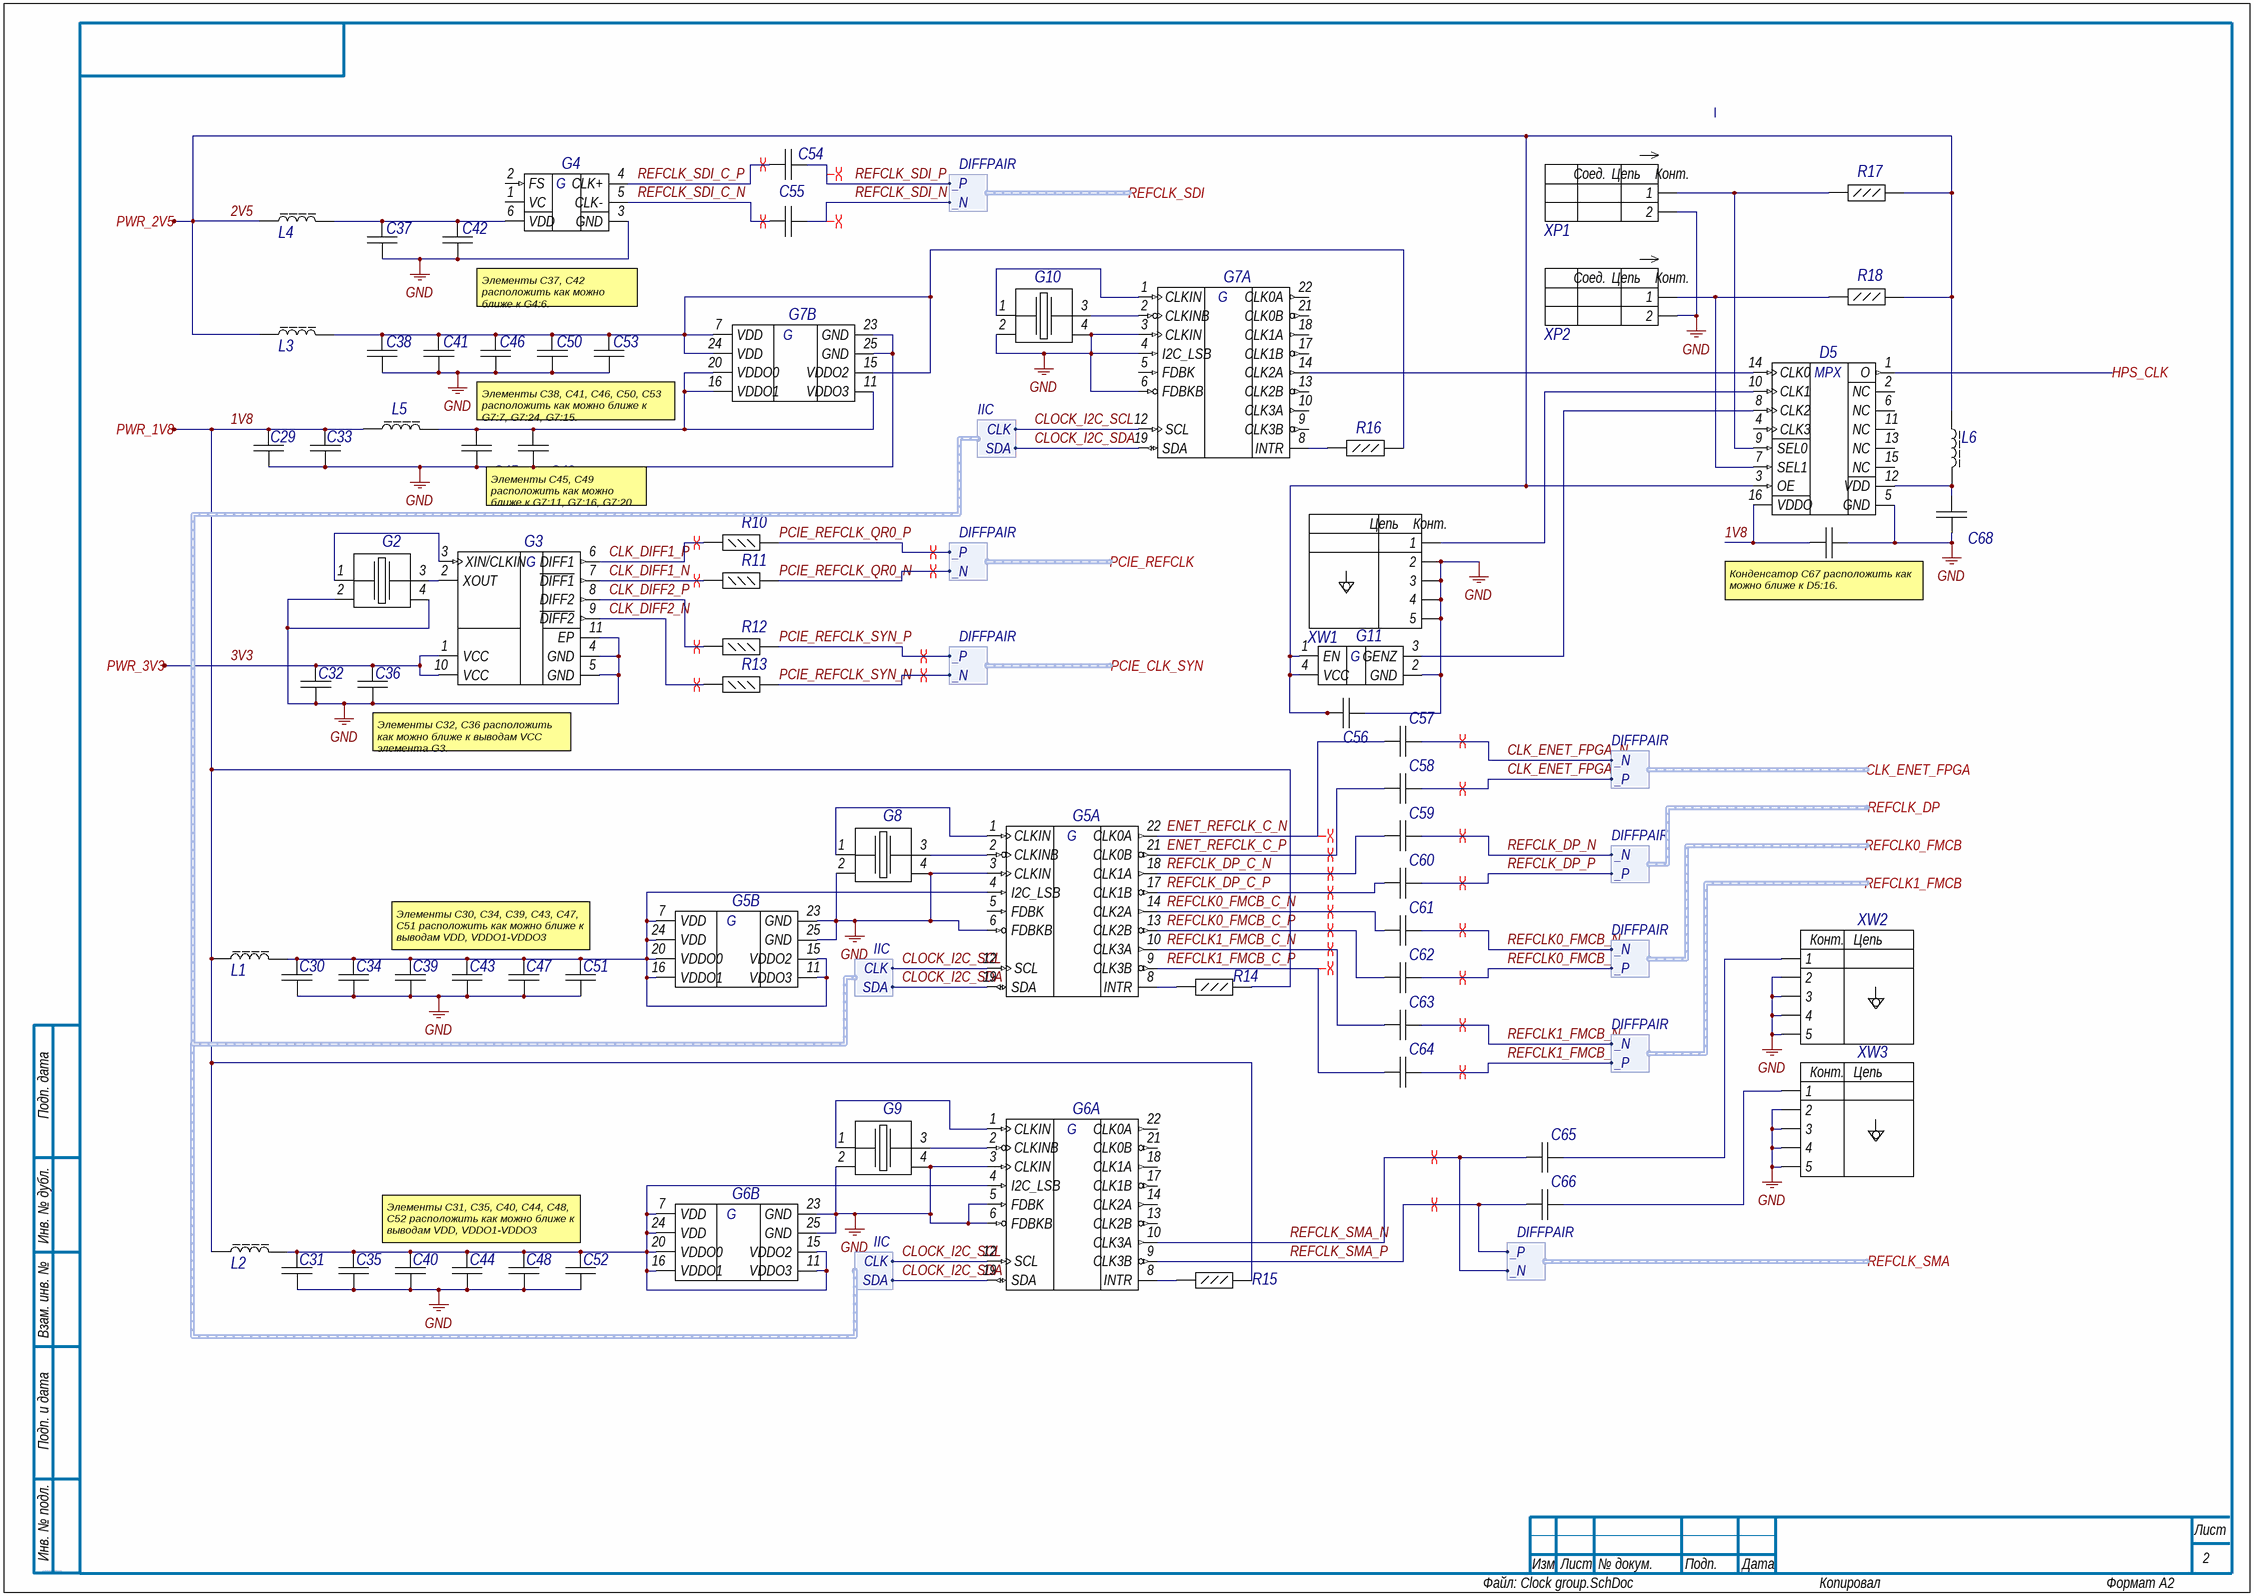
[diagram p28: Clock group.SchDoc]

### Parts
C29  C1005X7R1E104M  [CAPC1005X55X10LL05]  (value not drawn)
C30  C1005X7R1E104M  [CAPC1005X55X10LL05]  (value not drawn)
C31  C1005X7R1E104M  [CAPC1005X55X10LL05]  (value not drawn)
C32  C1005X7R1E104M  [CAPC1005X55X10LL05]  (value not drawn)
C33  C1005X7R1E104M  [CAPC1005X55X10LL05]  (value not drawn)
C34  C1005X7R1E104M  [CAPC1005X55X10LL05]  (value not drawn)
C35  C1005X7R1E104M  [CAPC1005X55X10LL05]  (value not drawn)
C36  GRM188R61A225KE34x  [CAPC1608X90X35ML10T15]  (value not drawn)
C37  C2012X5R1C106K085AC  [CAPC2013X100X20NL20]  (value not drawn)
C38  C1005X7R1E104M  [CAPC1005X55X10LL05]  (value not drawn)
C39  C1005X7R1E104M  [CAPC1005X55X10LL05]  (value not drawn)
C40  C1005X7R1E104M  [CAPC1005X55X10LL05]  (value not drawn)
C41  C1005X7R1E104M  [CAPC1005X55X10LL05]  (value not drawn)
C42  C1005X7R1E104M  [CAPC1005X55X10LL05]  (value not drawn)
C43  C1005X7R1E104M  [CAPC1005X55X10LL05]  (value not drawn)
C44  C1005X7R1E104M  [CAPC1005X55X10LL05]  (value not drawn)
C45  C1005X7R1E104M  [CAPC1005X55X10LL05]  (value not drawn)
C46  C1005X7R1E104M  [CAPC1005X55X10LL05]  (value not drawn)
C47  C1005X7R1E104M  [CAPC1005X55X10LL05]  (value not drawn)
C48  C1005X7R1E104M  [CAPC1005X55X10LL05]  (value not drawn)
C49  C1005X7R1E104M  [CAPC1005X55X10LL05]  (value not drawn)
C50  C1005X7R1E104M  [CAPC1005X55X10LL05]  (value not drawn)
C51  C1005X7R1E104M  [CAPC1005X55X10LL05]  (value not drawn)
C52  C1005X7R1E104M  [CAPC1005X55X10LL05]  (value not drawn)
C53  C1005X7R1E104M  [CAPC1005X55X10LL05]  (value not drawn)
C54  C1005X7R1E104M  [CAPC1005X55X10LL05]  (value not drawn)
C55  C1005X7R1E104M  [CAPC1005X55X10LL05]  (value not drawn)
C56  GRM155R71H103KA88D  [CAPC1005X55X25ML05T10]  (value not drawn)
C57  C1005X7R1E104M  [CAPC1005X55X10LL05]  (value not drawn)
C58  C1005X7R1E104M  [CAPC1005X55X10LL05]  (value not drawn)
C59  C1005X7R1E104M  [CAPC1005X55X10LL05]  (value not drawn)
C60  C1005X7R1E104M  [CAPC1005X55X10LL05]  (value not drawn)
C61  C1005X7R1E104M  [CAPC1005X55X10LL05]  (value not drawn)
C62  C1005X7R1E104M  [CAPC1005X55X10LL05]  (value not drawn)
C63  C1005X7R1E104M  [CAPC1005X55X10LL05]  (value not drawn)
C64  C1005X7R1E104M  [CAPC1005X55X10LL05]  (value not drawn)
C65  C1005X7R1E104M  [CAPC1005X55X10LL05]  (value not drawn)
C66  C1005X7R1E104M  [CAPC1005X55X10LL05]  (value not drawn)
C67  C1005X7R1E104M  [CAPC1005X55X10LL05]  (value not drawn)
C68  C1005X7R1E104M  [CAPC1005X55X10LL05]  (value not drawn)
D5  ICS83054AGILF  [IDT-TSSOP-16_M]  (value not drawn)
G2  FA-128 25.0000MB-C  [EPSON-FA-128_V]  (value not drawn)
G3  Si52112-A1-GM2  [SLAB-TDFN-10_L]  (value not drawn)
G4  516FHA000132AAG  [SLAB-DFN-6-5000X7000DE_A_V]  (value not drawn)
G5  Si5338B-B03799-GM  [SLAB-QFN-24-2550x2550TP_V]  (value not drawn)  (parts A,B of 2)
G6  Si5338B-B03799-GM  [SLAB-QFN-24-2550x2550TP_V]  (value not drawn)  (parts A,B of 2)
G7  Si5338C-B03798-GM  [SLAB-QFN-24-2550x2550TP_V]  (value not drawn)  (parts A,B of 2)
G8  FA-128 25.0000MB-C  [EPSON-FA-128_V]  (value not drawn)
G9  FA-128 25.0000MB-C  [EPSON-FA-128_V]  (value not drawn)
G10  FA-128 25.0000MB-C  [EPSON-FA-128_V]  (value not drawn)
G11  ASE2-33.000MHZ-ET  [ABRA-ASE2_V]  (value not drawn)
L1  BLM15AG221SN1J  [MURA-BLM15-CHIP-2_V]  (value not drawn)
L2  BLM15AG221SN1x  [MURA-BLM15AG221SN1x_V]  (value not drawn)
L3  742792780  [SMD-0402]  (value not drawn)
L4  BLM15AG221SN1x  [MURA-BLM15AG221SN1x_V]  (value not drawn)
L5  742792780  [SMD-0402]  (value not drawn)
L6  742792780  [SMD-0402]  (value not drawn)
R10  ERJ-2GE0R00X  [RESC1005X40X25LL05T05]  (value not drawn)
R11  ERJ-2GE0R00X  [RESC1005X40X25LL05T05]  (value not drawn)
R12  ERJ-2GE0R00X  [RESC1005X40X25LL05T05]  (value not drawn)
R13  ERJ-2GE0R00X  [RESC1005X40X25LL05T05]  (value not drawn)
R14  ERJ-2RKF4701X  [RESC1005X40X25LL05T05]  (value not drawn)
R15  ERJ-2RKF4701X  [RESC1005X40X25LL05T05]  (value not drawn)
R16  ERJ-2RKF1001X  [RESC1005X40X25LL05T05]  (value not drawn)
R17  ERJ-2RKF1001X  [RESC1005X40X25LL05T05]  (value not drawn)
R18  ERJ-2RKF1001X  [RESC1005X40X25LL05T05]  (value not drawn)
XP1  613 002 111 21  [WE-61300211121_V]  (value not drawn)
XP2  613 002 111 21  [WE-61300211121_V]  (value not drawn)
XW1  LTI-SASF54GT  [LHT-LTI-SASF54GT_V]  (value not drawn)
XW2  LTI-SASF54GT  [LHT-LTI-SASF54GT_V]  (value not drawn)
XW3  LTI-SASF54GT  [LHT-LTI-SASF54GT_V]  (value not drawn)

### Ports
CLK_ENET_FPGA (harness DIFFPAIR), HPS_CLK, PCIE_CLK_SYN (harness DIFFPAIR), PCIE_REFCLK (harness DIFFPAIR), PWR_1V8, PWR_2V5, PWR_3V3, REFCLK0_FMCB (harness DIFFPAIR), REFCLK1_FMCB (harness DIFFPAIR), REFCLK_DP (harness DIFFPAIR), REFCLK_SDI (harness DIFFPAIR), REFCLK_SMA (harness DIFFPAIR)

### Harnesses
DIFFPAIR: _P, _N
IIC: CLK, SDA

### Nets
GND: C29.1 C30.2 C31.2 C32.1 C33.1 C34.2 C35.2 C36.1 C37.1 C38.1 C39.2 C40.2 C41.1 C42.1 C43.2 C44.2 C45.1 C46.1 C47.2 C48.2 C49.1 C50.1 C51.2 C52.2 C53.1 C56.1 C67.1 C68.1 D5.5(GND) G2.2(GND) G2.4(GND) G3.4(GND) G3.5(GND) G3.11(EP) G4.3(GND) G5.3(CLKIN) G5.6(FDBKB) G5.23(GND) G5.25(GND) G6.3(CLKIN) G6.5(FDBK) G6.6(FDBKB) G6.23(GND) G6.25(GND) G7.3(CLKIN) G7.4(I2C_LSB) G7.6(FDBKB) G7.23(GND) G7.25(GND) G8.2(GND) G8.4(GND) G9.2(GND) G9.4(GND) G10.2(GND) G10.4(GND) G11.2(GND) XP1.2 XP2.2 XW1.2 XW1.3 XW1.4 XW1.5 XW2.2 XW2.3 XW2.4 XW2.5 XW3.2 XW3.3 XW3.4 XW3.5
1V8: C29.2 C33.2 C67.2 D5.16(VDDO) L1.2 L2.2 L5.2 R14.1 R15.1 ; port PWR_1V8  [project net IO_1V8]
2V5: C56.2 D5.3(OE) G11.1(EN) G11.4(VCC) L3.2 L4.2 L6.2 R17.1 R18.1 ; port PWR_2V5  [project net IO_2V5]
3V3: C32.2 C36.2 G3.1(VCC) G3.10(VCC) ; port PWR_3V3  [project net IO_3V3]
CLK_DIFF1_N: G3.7(~{DIFF1}) R11.1  [project net CLK_DIFF1_N_2]
CLK_DIFF1_P: G3.6(DIFF1) R10.1  [project net CLK_DIFF1_P_2]
CLK_DIFF2_N: G3.9(~{DIFF2}) R13.1  [project net CLK_DIFF2_N_2]
CLK_DIFF2_P: G3.8(DIFF2) R12.1  [project net CLK_DIFF2_P_2]
CLK_ENET_FPGA_N: C57.2 ; port CLK_ENET_FPGA._N
CLK_ENET_FPGA_P: C58.2 ; port CLK_ENET_FPGA._P
CLOCK_I2C_SCL: G5.12(SCL) G6.12(SCL) G7.12(SCL) ; harness IIC.CLK
CLOCK_I2C_SDA: G5.19(SDA) G6.19(SDA) G7.19(SDA) ; harness IIC.SDA
ENET_REFCLK_C_N: C57.1 G5.22(CLK0A)  [project net ENET_REFCLK_C_N_2]
ENET_REFCLK_C_P: C58.1 G5.21(CLK0B)  [project net ENET_REFCLK_C_P_2]
PCIE_REFCLK_QR0_N: R11.2 ; port PCIE_REFCLK._N
PCIE_REFCLK_QR0_P: R10.2 ; port PCIE_REFCLK._P
PCIE_REFCLK_SYN_N: R13.2 ; port PCIE_CLK_SYN._N
PCIE_REFCLK_SYN_P: R12.2 ; port PCIE_CLK_SYN._P
REFCLK0_FMCB_C_N: C61.1 G5.14(CLK2A)  [project net REFCLK0_FMCB_C_N_2]
REFCLK0_FMCB_C_P: C62.1 G5.13(CLK2B)  [project net REFCLK0_FMCB_C_P_2]
REFCLK0_FMCB_N: C61.2 ; port REFCLK0_FMCB._N
REFCLK0_FMCB_P: C62.2 ; port REFCLK0_FMCB._P
REFCLK1_FMCB_C_N: C63.1 G5.10(CLK3A)  [project net REFCLK1_FMCB_C_N_2]
REFCLK1_FMCB_C_P: C64.1 G5.9(CLK3B)  [project net REFCLK1_FMCB_C_P_2]
REFCLK1_FMCB_N: C63.2 ; port REFCLK1_FMCB._N
REFCLK1_FMCB_P: C64.2 ; port REFCLK1_FMCB._P
REFCLK_DP_C_N: C59.1 G5.18(CLK1A)  [project net REFCLK_DP_C_N_2]
REFCLK_DP_C_P: C60.1 G5.17(CLK1B)  [project net REFCLK_DP_C_P_2]
REFCLK_DP_N: C59.2 ; port REFCLK_DP._N
REFCLK_DP_P: C60.2 ; port REFCLK_DP._P
REFCLK_SDI_C_N: C55.2 G4.5(CLK-)  [project net REFCLK_SDI_C_N_2]
REFCLK_SDI_C_P: C54.2 G4.4(CLK+)  [project net REFCLK_SDI_C_P_2]
REFCLK_SDI_N: C55.1 ; port REFCLK_SDI._N
REFCLK_SDI_P: C54.1 ; port REFCLK_SDI._P
REFCLK_SMA_N: C65.1 G6.10(CLK3A) ; port REFCLK_SMA._N
REFCLK_SMA_P: C66.1 G6.9(CLK3B) ; port REFCLK_SMA._P
NetC30_1: C30.1 C34.1 C39.1 C43.1 C47.1 C51.1 G5.4(I2C_LSB) G5.7(VDD) G5.11(VDDO3) G5.15(VDDO2) G5.16(VDDO1) G5.20(VDDO0) G5.24(VDD) L1.1
NetC31_1: C31.1 C35.1 C40.1 C44.1 C48.1 C52.1 G6.4(I2C_LSB) G6.7(VDD) G6.11(VDDO3) G6.15(VDDO2) G6.16(VDDO1) G6.20(VDDO0) G6.24(VDD) L2.1
NetC37_2: C37.2 C42.2 G4.6(VDD) L4.1
NetC38_2: C38.2 C41.2 C46.2 C50.2 C53.2 G7.7(VDD) G7.15(VDDO2) G7.24(VDD) L3.1 R16.1
NetC45_2: C45.2 C49.2 G7.11(VDDO3) G7.16(VDDO1) G7.20(VDDO0) L5.1
NetC65_2: C65.2 XW2.1
NetC66_2: C66.2 XW3.1
NetC68_2: C68.2 D5.12(VDD) L6.1
NetD5_1: D5.1(O) ; port HPS_CLK
NetD5_7: D5.7(SEL1) R18.2 XP2.1
NetD5_8: D5.8(CLK2) G11.3(GENZ)
NetD5_9: D5.9(SEL0) R17.2 XP1.1
NetD5_10: D5.10(CLK1) XW1.1
NetD5_14: D5.14(CLK0) G7.14(CLK2A)
NetG2_1: G2.1(X1) G3.3(XIN/CLKIN)
NetG2_3: G2.3(X2) G3.2(XOUT)
NetG5_1: G5.1(CLKIN) G8.1(X1)
NetG5_2: G5.2(CLKINB) G8.3(X2)
NetG5_8: G5.8(INTR) R14.2
NetG6_1: G6.1(CLKIN) G9.1(X1)
NetG6_2: G6.2(CLKINB) G9.3(X2)
NetG6_8: G6.8(INTR) R15.2
NetG7_1: G7.1(CLKIN) G10.1(X1)
NetG7_2: G7.2(CLKINB) G10.3(X2)
NetG7_8: G7.8(INTR) R16.2

Not connected (* = marked no-connect by the designer): D5 2(NC) 4(CLK3) 6(NC) 11(NC) 13(NC) 15(NC); G4 1(VC) 2(FS); G5 5(FDBK); G6 13(CLK2B) 14(CLK2A) 17(CLK1B) 18(CLK1A) 21(CLK0B) 22(CLK0A); G7 5(FDBK) 9(CLK3B) 10(CLK3A) 13(CLK2B) 17(CLK1B) 18(CLK1A) 21(CLK0B) 22(CLK0A)

### Layout directives
differential pair: CLK_DIFF1_N_2, CLK_DIFF1_P_2, CLK_DIFF2_N_2, CLK_DIFF2_P_2, CLK_ENET_FPGA_N, CLK_ENET_FPGA_P, ENET_REFCLK_C_N_2, ENET_REFCLK_C_P_2, PCIE_REFCLK_QR0_N, PCIE_REFCLK_QR0_P, PCIE_REFCLK_SYN_N, PCIE_REFCLK_SYN_P, REFCLK0_FMCB_C_N_2, REFCLK0_FMCB_C_P_2, REFCLK0_FMCB_N, REFCLK0_FMCB_P, REFCLK1_FMCB_C_N_2, REFCLK1_FMCB_C_P_2, REFCLK1_FMCB_N, REFCLK1_FMCB_P, REFCLK_DP_C_N_2, REFCLK_DP_C_P_2, REFCLK_DP_N, REFCLK_DP_P, REFCLK_SDI_C_N_2, REFCLK_SDI_C_P_2, REFCLK_SDI_N, REFCLK_SDI_P, REFCLK_SMA_N, REFCLK_SMA_P

### Notes on the sheet
- Элементы C37, C42 расположить как можно ближе к G4:6.
- Элементы C38, C41, C46, C50, C53 расположить как можно ближе к G7:7, G7:24, G7:15.
- Элементы C45, C49 расположить как можно ближе к G7:11, G7:16, G7:20.
- (near C67) Конденсатор C67 расположить как можно ближе к D5:16.
- Элементы C32, C36 расположить как можно ближе к выводам VCC элемента G3.
- Элементы C30, C34, C39, C43, C47, C51 расположить как можно ближе к выводам VDD, VDDO1-VDDO3 элемента G5.
- Элементы C31, C35, C40, C44, C48, C52 расположить как можно ближе к выводам VDD, VDDO1-VDDO3 элемента G6.
- Подп. дата
- Инв. № дубл.
- Взам. инв. №
- Подп. и дата
- Инв. № подл.
- Изм.
- Лист
- № докум.
- Подп.
- Дата
- ALTIUM GOSTBOM2.0 KEV
- Файл:
- Копировал
- Формат А2
- (in symbol E32) Соед.; Цепь; Конт.
- (in symbol E42) Цепь; Конт.
- (in symbol E122, part A) G
- (in symbol E122, part B) G
- (in symbol E123) G
- (in symbol E124, part A) G
- (in symbol E124, part B) G
- (in symbol E125) MPX
- (in symbol E126) G
- (in symbol E128) G